# Altium schematic sheet MAX_BUS.SchDoc: ATLAS_XP2V5
size 558 x 431 mm; Organization: IMP Automatika d.o.o.; Revision: V5
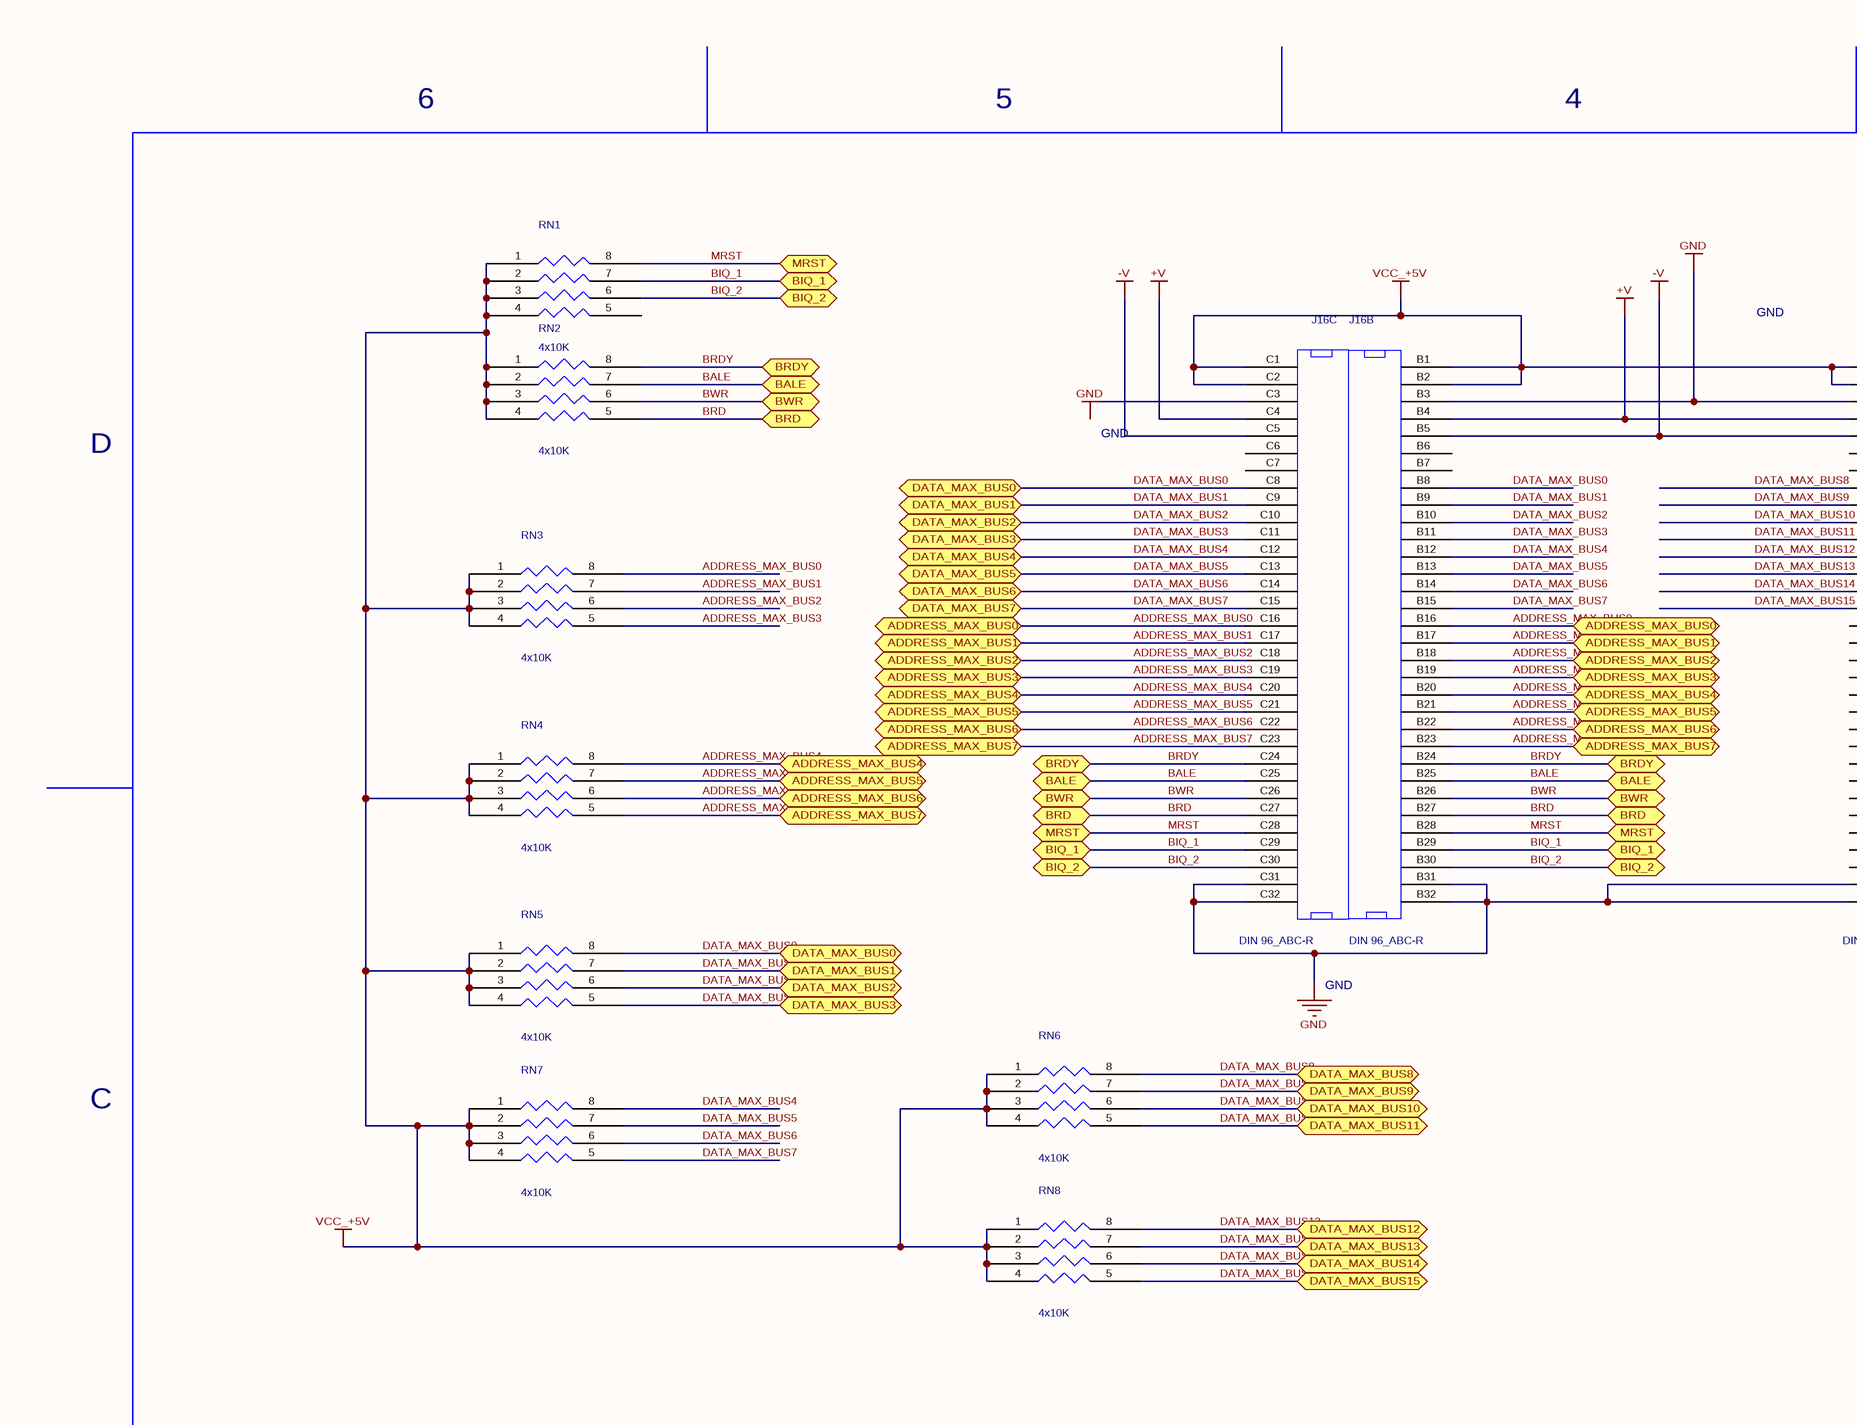
[diagram p0: MAX_BUS.SchDoc, top left]
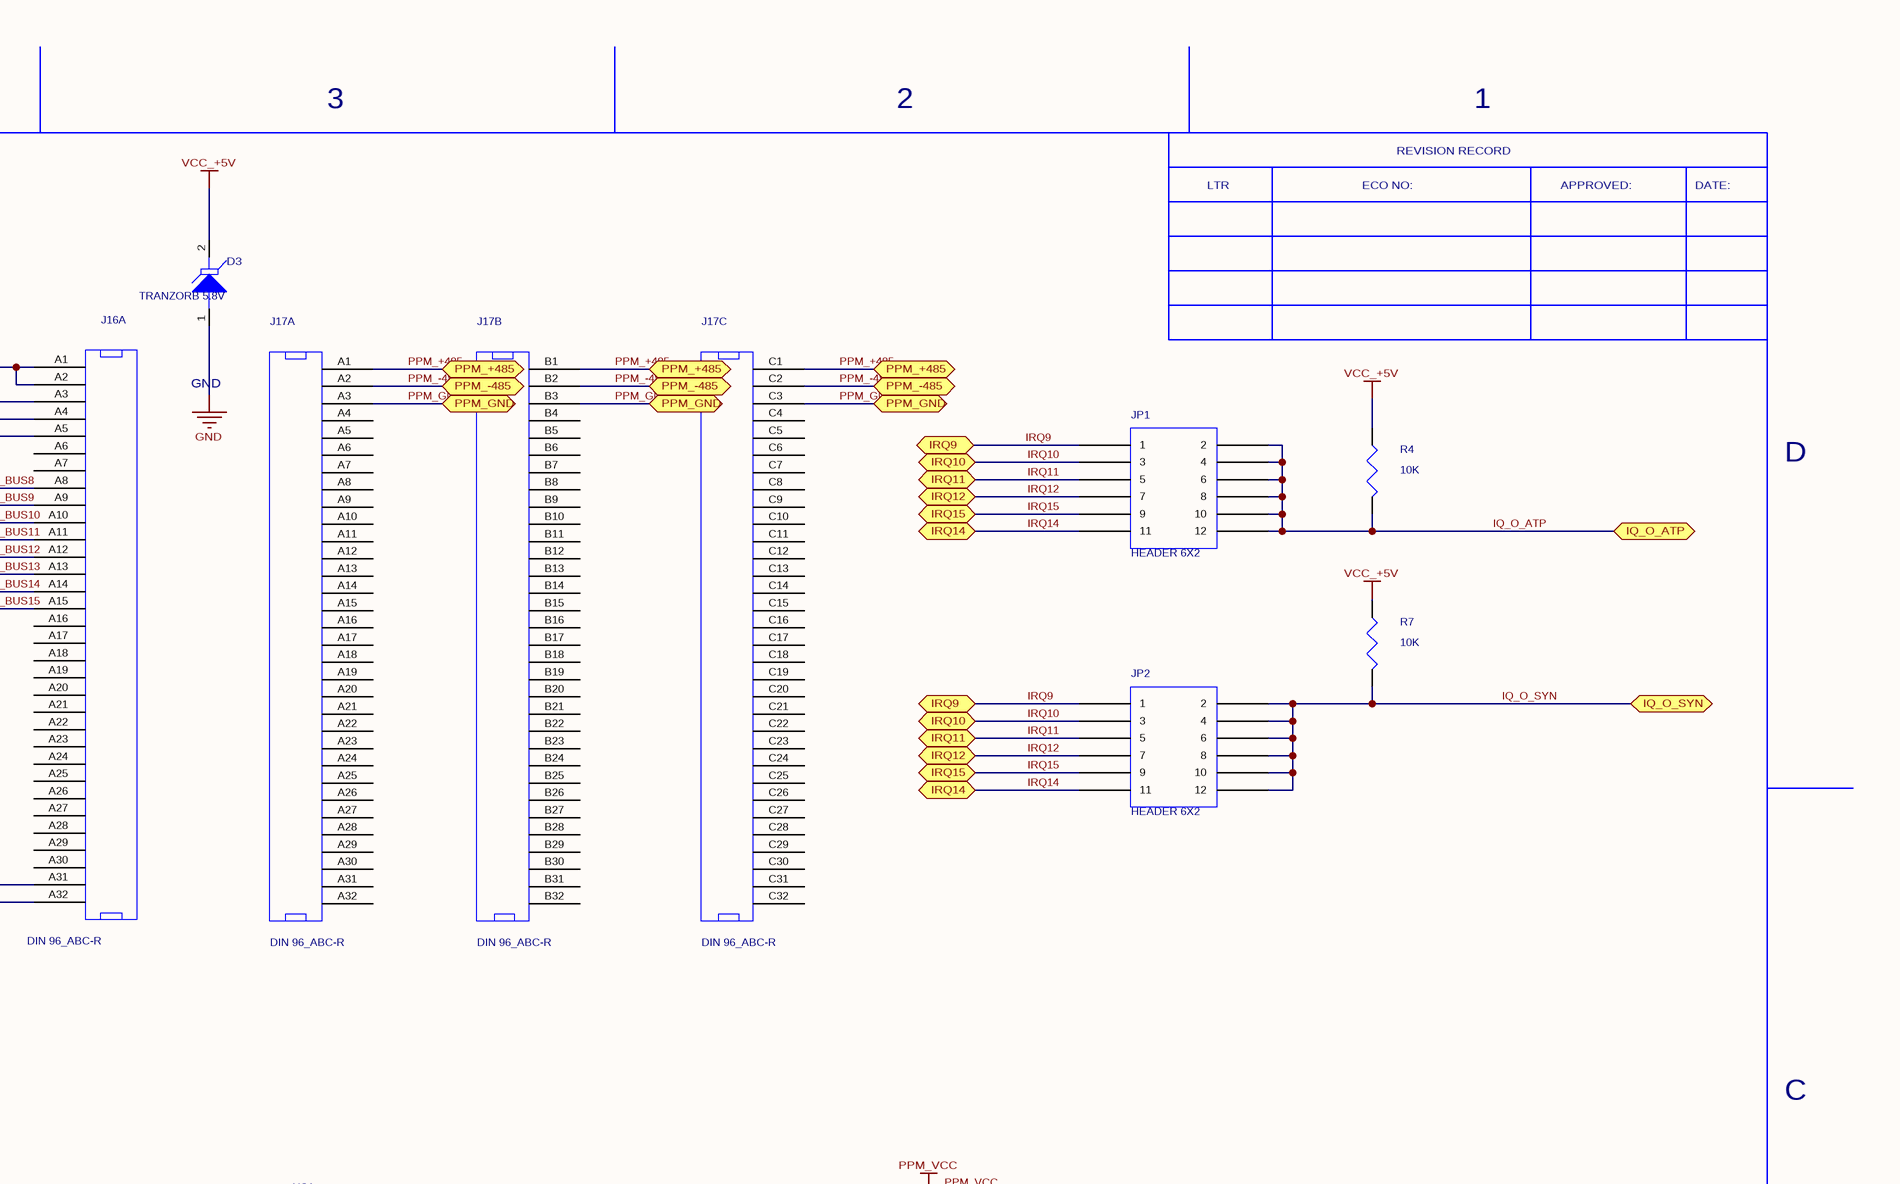
[diagram p1: MAX_BUS.SchDoc, top right]
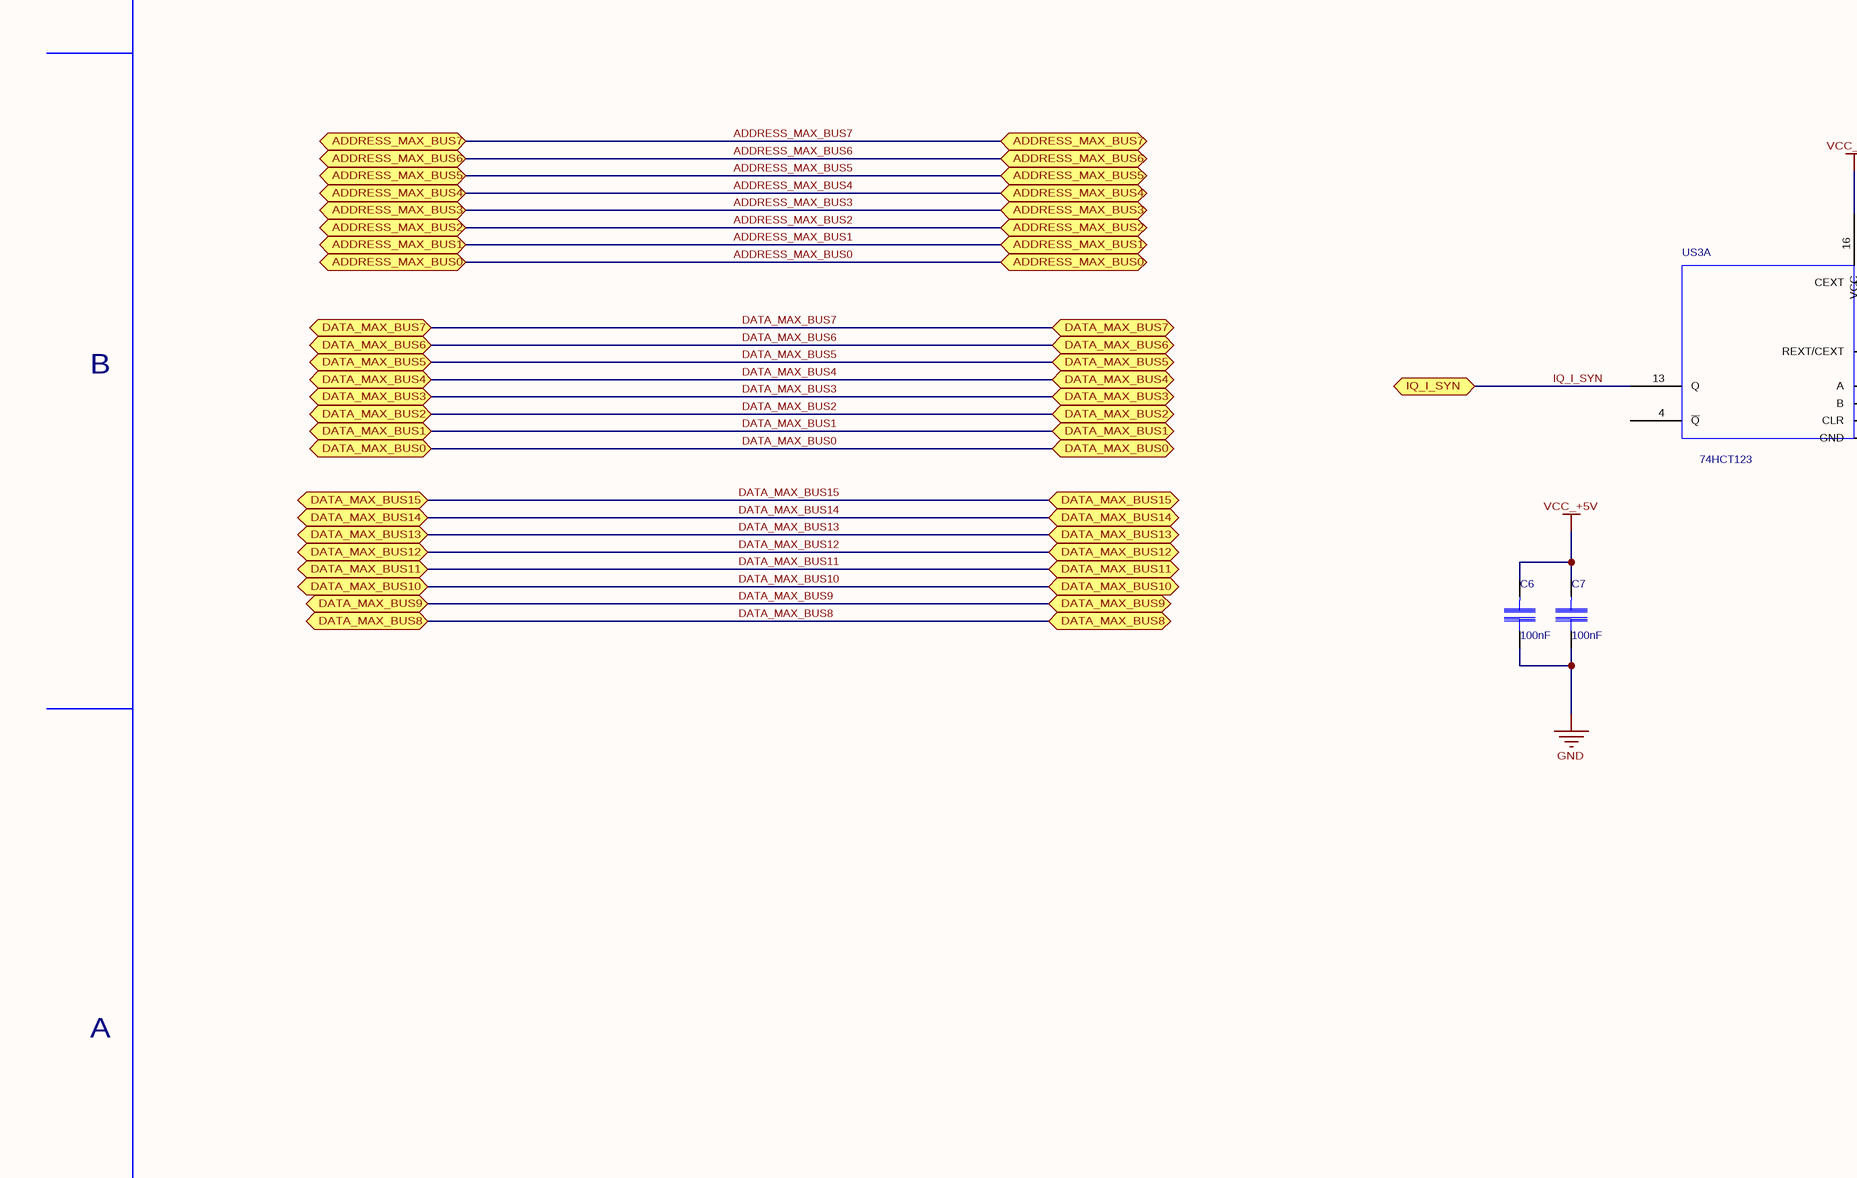
[diagram p2: MAX_BUS.SchDoc, bottom left]
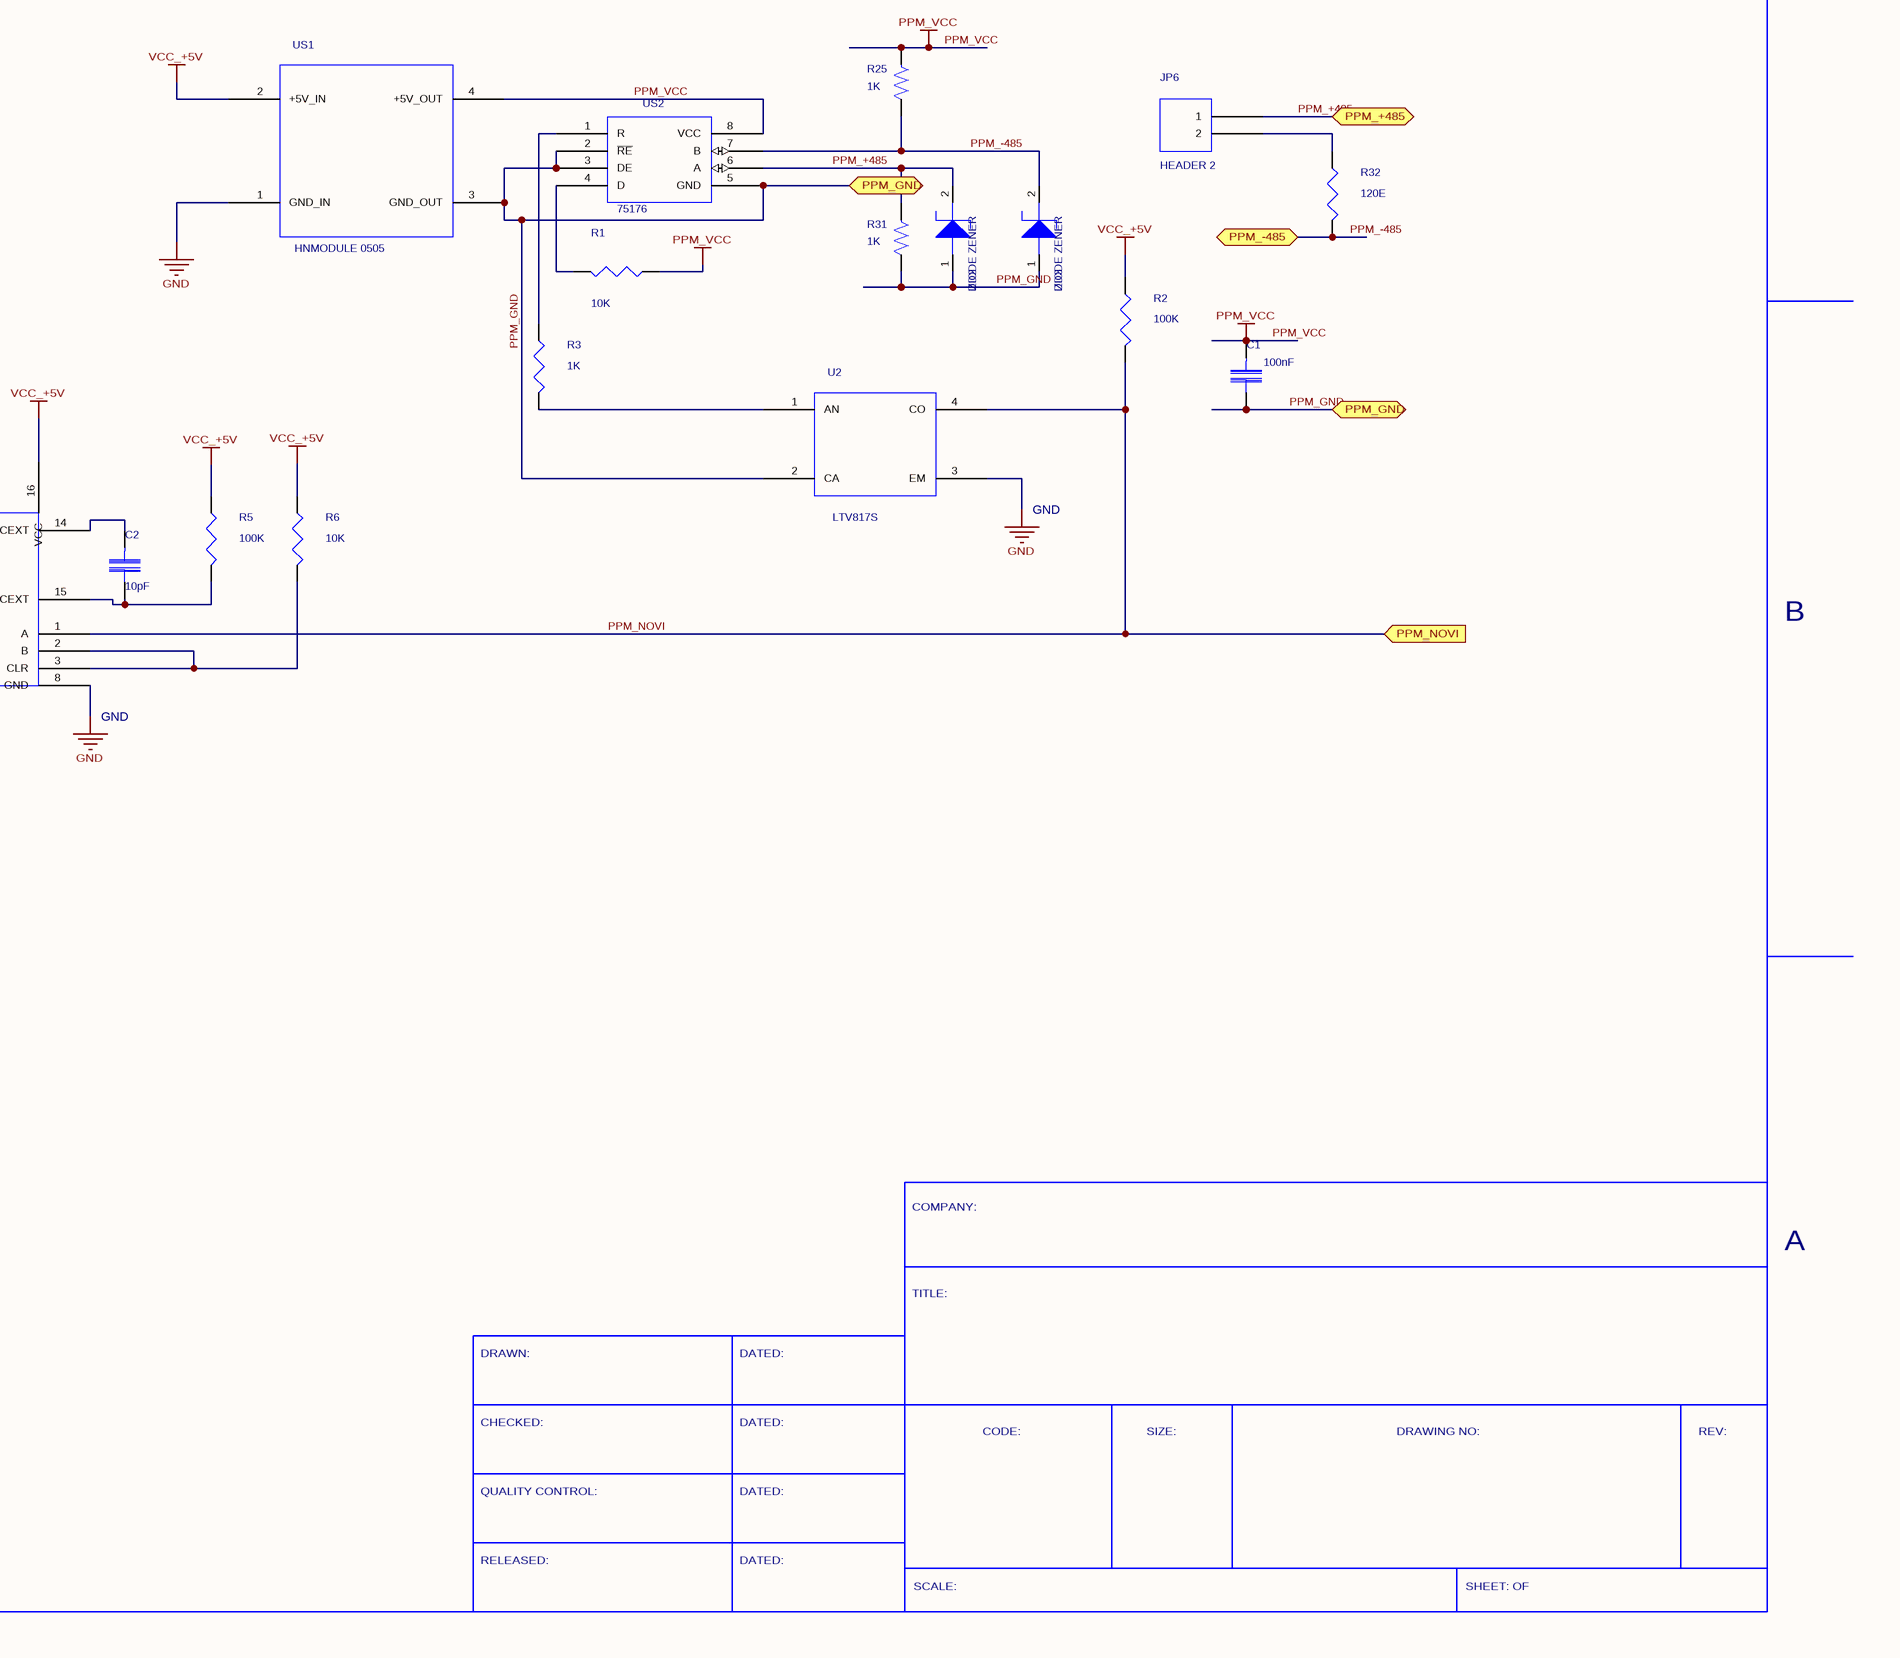
[diagram p3: MAX_BUS.SchDoc, bottom right]

## Parts
C1  value 100nF  [SM/C_0805]  (hidden comment: C)
C2  value 10pF  [SM/C_0805]  (hidden comment: C)
C6  value 100nF  [SM/C_0805]  (hidden comment: C)
C7  value 100nF  [SM/C_0805]  (hidden comment: C)
D3  value TRANZORB 5.8V  [SM/DO214AC_21]  (hidden comment: TRANZORB_0)
J16  value DIN 96_ABC-R  [DIN96_ABC/R]  (hidden comment: DIN_96_ABC-R)  (parts A,B,C of 3)
J17  value DIN 96_ABC-R  [DIN96_ABC/R]  (hidden comment: DIN_96_ABC-R)  (parts A,B,C of 3)
JP1  value HEADER 6X2  [BLKCON.100/VH/TM2OE/W.200/12]  (hidden comment: HEADER_6X2)
JP2  value HEADER 6X2  [BLKCON.100/VH/TM2OE/W.200/12]  (hidden comment: HEADER_6X2)
JP6  value HEADER 2  [JUMPER_100]  (hidden comment: HEADER_2)
R1  value 10K  [SM/R_1206]  (hidden comment: RESISTOR_2)
R2  value 100K  [SM/R_1206]  (hidden comment: RESISTOR_2)
R3  value 1K  [SM/R_1206]  (hidden comment: RESISTOR_2)
R4  value 10K  [SM/R_1206]  (hidden comment: RESISTOR_2)
R5  value 100K  [SM/R_1206]  (hidden comment: RESISTOR_2)
R6  value 10K  [SM/R_1206]  (hidden comment: RESISTOR_2)
R7  value 10K  [SM/R_1206]  (hidden comment: RESISTOR_2)
R25  value 1K  [SM/R_1206]  (hidden comment: R)
R31  value 1K  [SM/R_1206]  (hidden comment: R)
R32  value 120E  [SM/R_1206]  (hidden comment: RESISTOR_2)
RN1  value 4x10K  [SMD_RX4]  (hidden comment: RESAR_IS_4/SM)
RN2  value 4x10K  [SMD_RX4]  (hidden comment: RESAR_IS_4/SM)
RN3  value 4x10K  [SMD_RX4]  (hidden comment: RESAR_IS_4/SM)
RN4  value 4x10K  [SMD_RX4]  (hidden comment: RESAR_IS_4/SM)
RN5  value 4x10K  [SMD_RX4]  (hidden comment: RESAR_IS_4/SM)
RN6  value 4x10K  [SMD_RX4]  (hidden comment: RESAR_IS_4/SM)
RN7  value 4x10K  [SMD_RX4]  (hidden comment: RESAR_IS_4/SM)
RN8  value 4x10K  [SMD_RX4]  (hidden comment: RESAR_IS_4/SM)
U2  value LTV817S  [LTV814S]  (hidden comment: LTV-817_0)
US1  value HNMODULE 0505  [DCDC55]  (hidden comment: HNMODUL0505)
US2  75176  [SOG.050/8/WG.244/L.225]
US3  value 74HCT123  [SOG.050/16/WG.244/L.375]  (hidden comment: 74HC123_0)  (part A of 2)
ZD2  value DIODE ZENER  [SM/D_1206_21]  (hidden comment: DIODE_ZENER_0)
ZD3  value DIODE ZENER  [SM/D_1206_21]  (hidden comment: DIODE_ZENER_0)

## Ports
ADDRESS_MAX_BUS0 (bidir), ADDRESS_MAX_BUS1 (bidir), ADDRESS_MAX_BUS2 (bidir), ADDRESS_MAX_BUS3 (bidir), ADDRESS_MAX_BUS4 (bidir), ADDRESS_MAX_BUS5 (bidir), ADDRESS_MAX_BUS6 (bidir), ADDRESS_MAX_BUS7 (bidir), BALE (bidir), BIQ_1 (bidir), BIQ_2 (bidir), BRD (bidir), BRDY (bidir), BWR (bidir), DATA_MAX_BUS0 (bidir), DATA_MAX_BUS1 (bidir), DATA_MAX_BUS2 (bidir), DATA_MAX_BUS3 (bidir), DATA_MAX_BUS4 (bidir), DATA_MAX_BUS5 (bidir), DATA_MAX_BUS6 (bidir), DATA_MAX_BUS7 (bidir), DATA_MAX_BUS8 (bidir), DATA_MAX_BUS9 (bidir), DATA_MAX_BUS10 (bidir), DATA_MAX_BUS11 (bidir), DATA_MAX_BUS12 (bidir), DATA_MAX_BUS13 (bidir), DATA_MAX_BUS14 (bidir), DATA_MAX_BUS15 (bidir), IQ_I_SYN (bidir), IQ_O_ATP (bidir), IQ_O_SYN (bidir), IRQ9 (bidir), IRQ10 (bidir), IRQ11 (bidir), IRQ12 (bidir), IRQ14 (bidir), IRQ15 (bidir), MRST (bidir), PPM_+485 (bidir), PPM_-485 (bidir), PPM_GND (bidir), PPM_NOVI

## Nets
+V: J16.A4 J16.B4 J16.C4
-V: J16.A5 J16.B5 J16.C5
GND: C6.2 C7.2 D3.1(ANODE) J16.A3 J16.A31 J16.A32 J16.B3 J16.B31 J16.B32 J16.C3 J16.C31 J16.C32 U2.3(EM) US1.1(GND_IN) US3.8(GND)
PPM_VCC: C1.1 R1.1 R25.1 US1.4(+5V_OUT) US2.8(VCC)
VCC_+5V: C6.1 C7.1 D3.2(CATHODE) J16.A1 J16.A2 J16.B1 J16.B2 J16.C1 J16.C2 R2.1 R4.1 R5.1 R6.1 R7.1 RN1.1 RN1.2 RN1.3 RN1.4 RN2.1 RN2.2 RN2.3 RN2.4 RN3.1 RN3.2 RN3.3 RN3.4 RN4.1 RN4.2 RN4.3 RN4.4 RN5.1 RN5.2 RN5.3 RN5.4 RN6.1 RN6.2 RN6.3 RN6.4 RN7.1 RN7.2 RN7.3 RN7.4 RN8.1 RN8.2 RN8.3 RN8.4 US1.2(+5V_IN) US3.16(VCC)
ADDRESS_MAX_BUS0: J16.B16 J16.C16 RN3.8 ; port ADDRESS_MAX_BUS0
ADDRESS_MAX_BUS1: J16.B17 J16.C17 RN3.7 ; port ADDRESS_MAX_BUS1
ADDRESS_MAX_BUS2: J16.B18 J16.C18 RN3.6 ; port ADDRESS_MAX_BUS2
ADDRESS_MAX_BUS3: J16.B19 J16.C19 RN3.5 ; port ADDRESS_MAX_BUS3
ADDRESS_MAX_BUS4: J16.B20 J16.C20 RN4.8 ; port ADDRESS_MAX_BUS4
ADDRESS_MAX_BUS5: J16.B21 J16.C21 RN4.7 ; port ADDRESS_MAX_BUS5
ADDRESS_MAX_BUS6: J16.B22 J16.C22 RN4.6 ; port ADDRESS_MAX_BUS6
ADDRESS_MAX_BUS7: J16.B23 J16.C23 RN4.5 ; port ADDRESS_MAX_BUS7
BALE: J16.B25 J16.C25 RN2.7 ; port BALE
BIQ_1: J16.B29 J16.C29 RN1.7 ; port BIQ_1
BIQ_2: J16.B30 J16.C30 RN1.6 ; port BIQ_2
BRD: J16.B27 J16.C27 RN2.5 ; port BRD
BRDY: J16.B24 J16.C24 RN2.8 ; port BRDY
BWR: J16.B26 J16.C26 RN2.6 ; port BWR
DATA_MAX_BUS0: J16.B8 J16.C8 RN5.8 ; port DATA_MAX_BUS0
DATA_MAX_BUS1: J16.B9 J16.C9 RN5.7 ; port DATA_MAX_BUS1
DATA_MAX_BUS2: J16.B10 J16.C10 RN5.6 ; port DATA_MAX_BUS2
DATA_MAX_BUS3: J16.B11 J16.C11 RN5.5 ; port DATA_MAX_BUS3
DATA_MAX_BUS4: J16.B12 J16.C12 RN7.8 ; port DATA_MAX_BUS4
DATA_MAX_BUS5: J16.B13 J16.C13 RN7.7 ; port DATA_MAX_BUS5
DATA_MAX_BUS6: J16.B14 J16.C14 RN7.6 ; port DATA_MAX_BUS6
DATA_MAX_BUS7: J16.B15 J16.C15 RN7.5 ; port DATA_MAX_BUS7
DATA_MAX_BUS8: J16.A8 RN6.8 ; port DATA_MAX_BUS8
DATA_MAX_BUS9: J16.A9 RN6.7 ; port DATA_MAX_BUS9
DATA_MAX_BUS10: J16.A10 RN6.6 ; port DATA_MAX_BUS10
DATA_MAX_BUS11: J16.A11 RN6.5 ; port DATA_MAX_BUS11
DATA_MAX_BUS12: J16.A12 RN8.8 ; port DATA_MAX_BUS12
DATA_MAX_BUS13: J16.A13 RN8.7 ; port DATA_MAX_BUS13
DATA_MAX_BUS14: J16.A14 RN8.6 ; port DATA_MAX_BUS14
DATA_MAX_BUS15: J16.A15 RN8.5 ; port DATA_MAX_BUS15
IQ_I_SYN: US3.13(Q) ; port IQ_I_SYN
IQ_O_ATP: JP1.2 JP1.4 JP1.6 JP1.8 JP1.10 JP1.12 R4.2 ; port IQ_O_ATP
IQ_O_SYN: JP2.2 JP2.4 JP2.6 JP2.8 JP2.10 JP2.12 R7.2 ; port IQ_O_SYN
IRQ9: JP1.1 JP2.1 ; port IRQ9
IRQ10: JP1.3 JP2.3 ; port IRQ10
IRQ11: JP1.5 JP2.5 ; port IRQ11
IRQ12: JP1.7 JP2.7 ; port IRQ12
IRQ14: JP1.11 JP2.11 ; port IRQ14
IRQ15: JP1.9 JP2.9 ; port IRQ15
MRST: J16.B28 J16.C28 RN1.8 ; port MRST
PPM_+485: J17.A1 J17.B1 J17.C1 JP6.1 R31.1 US2.6(A) ZD2.2(CATHODE) ; port PPM_+485
PPM_-485: J17.A2 J17.B2 J17.C2 R25.2 R32.2 US2.7(B) ZD3.2(CATHODE) ; port PPM_-485
PPM_GND: C1.2 J17.A3 J17.B3 J17.C3 R31.2 U2.2(CA) US1.3(GND_OUT) US2.2(~{RE}) US2.3(DE) US2.5(GND) ZD2.1(ANODE) ZD3.1(ANODE) ; port PPM_GND
PPM_NOVI: R2.2 U2.4(CO) US3.1(A) ; port PPM_NOVI
NetC2_1: C2.1 US3.14(CEXT)
NetC2_2: C2.2 R5.2 US3.15(REXT/CEXT)
NetJP6_2: JP6.2 R32.1
NetR1_2: R1.2 US2.4(D)
NetR3_1: R3.1 US2.1(R)
NetR3_2: R3.2 U2.1(AN)
NetR6_2: R6.2 US3.2(B) US3.3(CLR)

Not connected (* = marked no-connect by the designer): J16 A6 A7 A16 A17 A18 A19 A20 A21 A22 A23 A24 A25 A26 A27 A28 A29 A30 B6 B7 C6 C7; J17 A4 A5 A6 A7 A8 A9 A10 A11 A12 A13 A14 A15 A16 A17 A18 A19 A20 A21 A22 A23 A24 A25 A26 A27 A28 A29 A30 A31 A32 B4 B5 B6 B7 B8 B9 B10 B11 B12 B13 B14 B15 B16 B17 B18 B19 B20 B21 B22 B23 B24 B25 B26 B27 B28 B29 B30 B31 B32 C4 C5 C6 C7 C8 C9 C10 C11 C12 C13 C14 C15 C16 C17 C18 C19 C20 C21 C22 C23 C24 C25 C26 C27 C28 C29 C30 C31 C32; RN1 5; US3 4(~{Q})

## Notes on the sheet
- 6
- 5
- 4
- 3
- 2
- 1
- LTR
- ECO NO:
- REVISION RECORD
- APPROVED:
- DATE:
- GND
- D
- C
- B
- (near US3) GND
- COMPANY:
- A
- TITLE:
- DRAWN:
- DATED:
- CHECKED:
- CODE:
- SIZE:
- DRAWING NO:
- REV:
- QUALITY CONTROL:
- RELEASED:
- SCALE:
- SHEET: OF

## Library data of the parts
C1 C2 C6 C7 = C: Source_Path: D:\ORCADWIN\CAPTURE\ATP_LATT_01\ATP_00.OLB; SDTSourceLibName: C:\WINDOWS\TEMP\ATP_00.LIB; PCB DECAL: SM/C_0805
D3 = TRANZORB_0: Source_Path: C:\CADENCE\PSD_15.1\TOOLS\ATLAS_ITA\ATLAS_ITA.DSN; PCB DECAL: SM/DO214AC_21
J16 J17 = DIN_96_ABC-R: Source_Path: C:\ORCAD\ORCAD_10.5\TOOLS\CAPTURE\LIBRARY\CONNECTOR.OLB; PCB DECAL: DIN96_ABC/R
JP1 JP2 = HEADER_6X2: Source_Path: D:\ORCADWIN\CAPTURE\PTA\PC2A_00.OLB; SDTSourceLibName: C:\WINDOWS\TEMP\PC2A_00.LIB; PCB DECAL: BLKCON.100/VH/TM2OE/W.200/12
JP6 = HEADER_2: Source_Path: D:\ORCADWIN\CAPTURE\PTA\PC2A_00.OLB; SDTSourceLibName: C:\WINDOWS\TEMP\PC2A_00.LIB; PCB DECAL: JUMPER_100
R1-R7 R32 = RESISTOR_2: Source_Path: C:\CADENCE\PSD_15.1\TOOLS\CAPTURE\LIBRARY\DISCRETE.OLB; PCB DECAL: SM/R_1206
R25 R31 = R: Source_Path: C:\ORCAD\ORCAD_10.0\TOOLS\CAPTURE\LIBRARY\PSPICE\ANALOG.OLB; DIST: FLAT; PSpiceTemplate: R^@REFDES %1 %2 ?TOLERANCE|R^@REFDES| @VALUE  ?TOLERANCE|\n.model R^@REFDES RES R=1 DEV=@TOLERANCE%|; VOLTAGE: RVMAX; SLOPE: RSMAX; MAX_TEMP: RTMAX; POWER: RMAX; PCB DECAL: SM/R_1206
RN1-RN8 = RESAR_IS_4/SM: Source_Path: C:\ORCAD\ORCAD_10.5\TOOLS\CAPTURE\LIBRARY\DISCRETE.OLB; PCB DECAL: SMD_RX4
U2 = LTV-817_0: Source_Path: E:\MILOS\PROJECTS\ATLAS_XP\ATLAS_XP.DSN; PCB DECAL: LTV814S
US1 = HNMODUL0505: Source_Path: C:\PROJECTS\ATLAS_ITA\LIBRARY1.OLB; PCB DECAL: DCDC55
US2 = 75176: Source_Path: C:\ORCADESP\SDT\LIBRARY\TARIFA_O.OLB; PCB DECAL: SOG.050/8/WG.244/L.225; Value: 75176
US3 = 74HC123_0: Source_Path: E:\MILOS\PROJECTS\ATLAS_XP\ATLAS_XP.DSN; PCB DECAL: SOG.050/16/WG.244/L.375
ZD2 ZD3 = DIODE_ZENER_0: Source_Path: C:\PROJECTS\VHDL_PROJEKTI\BIS32W_ORCAD\BIS32W\BIS32_16.DSN; PCB DECAL: SM/D_1206_21